# EAGLE design rotator_interface (EAGLE 6.1)
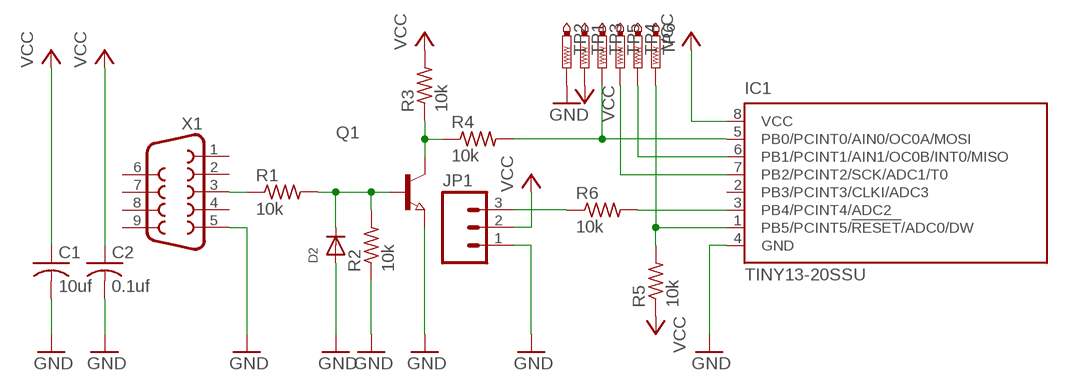
[diagram p0: schematic, sheet 1]

## Parts
C1  10uf  C-USC1206  [C1206]
C2  0.1uf  C-USC1206  [C1206]
D2  DIODESOD-123  [SOD-123]
IC1  TINY13-20SSU  [8S1]
JP1  M03PTH  [1X03]
Q1  NPN-TRANSISTOR_SOT23  [SOT23]
R1  10k  R-US_R1206  [R1206]
R2  10k  R-US_R1206  [R1206]
R3  10k  R-US_R1206  [R1206]
R4  10k  R-US_R1206  [R1206]
R5  10k  R-US_R1206  [R1206]
R6  10k  R-US_R1206  [R1206]
TP1  PTR1B1,27  [B1,27]
TP2  PTR1B1,27  [B1,27]
TP3  PTR1B1,27  [B1,27]
TP4  PTR1B1,27  [B1,27]
TP5  PTR1B1,27  [B1,27]
TP6  PTR1B1,27  [B1,27]
X1  DB9FEMALE  [DB9]

## Nets
GND: C1.2 C2.2 D2.A IC1.4(GND) JP1.1 Q1.2(E) R2.1 TP2.TP X1.5
N$1: Q1.3(C) R3.1 R4.1
N$2: D2.C Q1.1(B) R1.2 R2.2
N$3: R1.1 X1.3
N$4: IC1.5(PB0/PCINT0/AIN0/OC0A/MOSI) R4.2 TP3.TP
N$5: IC1.1(PB5/PCINT5/!RESET!/ADC0/DW) R5.2 TP6.TP
N$6: IC1.6(PB1/PCINT1/AIN1/OC0B/INT0/MISO) TP4.TP
N$7: IC1.7(PB2/PCINT2/SCK/ADC1/T0) TP5.TP
N$8: IC1.3(PB4/PCINT4/ADC2) R6.2
N$9: JP1.3 R6.1
VCC: C1.1 C2.1 IC1.8(VCC) JP1.2 R3.2 R5.1 TP1.TP
Unconnected: IC1.2(PB3/PCINT3/CLKI/ADC3) X1.1 X1.2 X1.4 X1.6 X1.7 X1.8 X1.9

## Library data of the parts
C1 C2 = adafruit:C-US: CAPACITOR, American symbol
D2 = adafruit:DIODE: Diode SMADIODE - SMA Surface Mount Package 20V 1A Schottky Diode Digikey: 641-1014-6-ND DO-1N4148 - Through Hole Small Current Diode SOD-123 20V 1 A (.5mV Vf) Schottky Diode - Digikey: MBRX120TPMSCT-ND SOD-323 10V 570mA (.38mV Vf, 3ns) Schottky Diode - Digikey: ZLLS410CT-ND SOD-523 30V 30mA Schottky Diode (RB751S-40TE61) - Digikey: RB751S-40TE61CT-ND SOT23-R/W - SOT23 Package (R = Solder Paste/Reflow Ovens, W = Hand-Soldering) BAT54Film 40V 300mA - Digikey: 497-7162-1-ND
IC1 = atmel:TINY13: 8-bit AVR Microcontroller with 1K Bytes In-System Programmable Flash Source: http://www.atmel.com/dyn/resources/prod_documents/2535S.pdf; MPN: ATTINY13-20SSU; OC_FARNELL: 1455133; OC_NEWARK: 58M3771
JP1 = sparkfun:M03: Header 3 Standard 3-pin 0.1" header. Use with straight break away headers (SKU : PRT-00116), right angle break away headers (PRT-00553), swiss pins (PRT-00743), machine pins (PRT-00117), and female headers (PRT-00115). Molex polarized connector foot print use with SKU : PRT-08232 with associated crimp pins and housings.
Q1 = semicon-smd-ipc:NPN-TRANSISTOR_: NPN TRANSISTOR
R1-R6 = resistor:R-US_: RESISTOR, American symbol
TP1-TP6 = testpad:PTR1: TEST PIN
X1 = sparkfun:DB9: DB9 Connector Standard DB9 (D-Sub 9) serial connector. Can be used for CAN bus as well as RS485 and RS232. Footprint production proven. Spark Fun Electronics SKU : PRT-00429

## Board
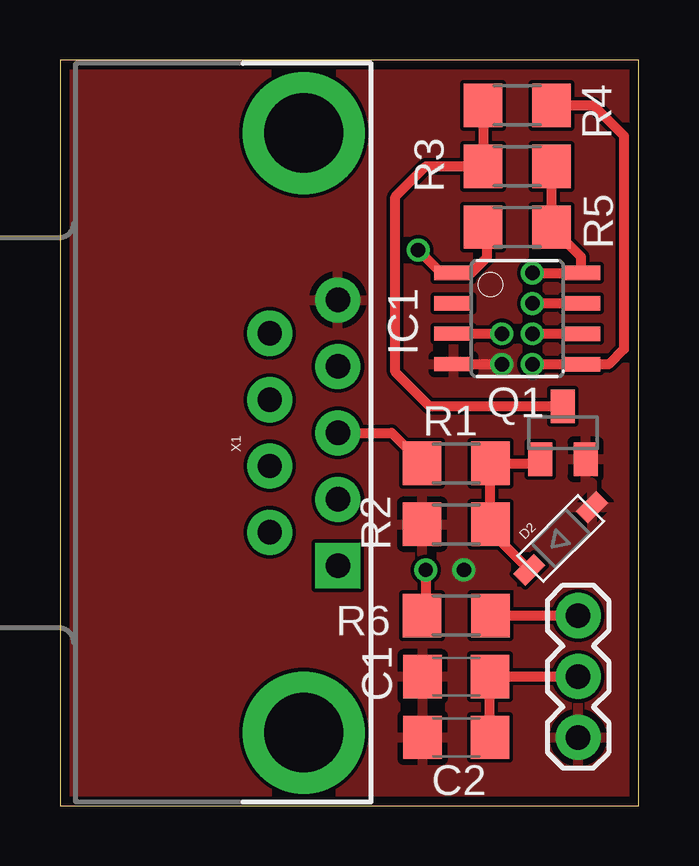
[diagram p1: board, top side]
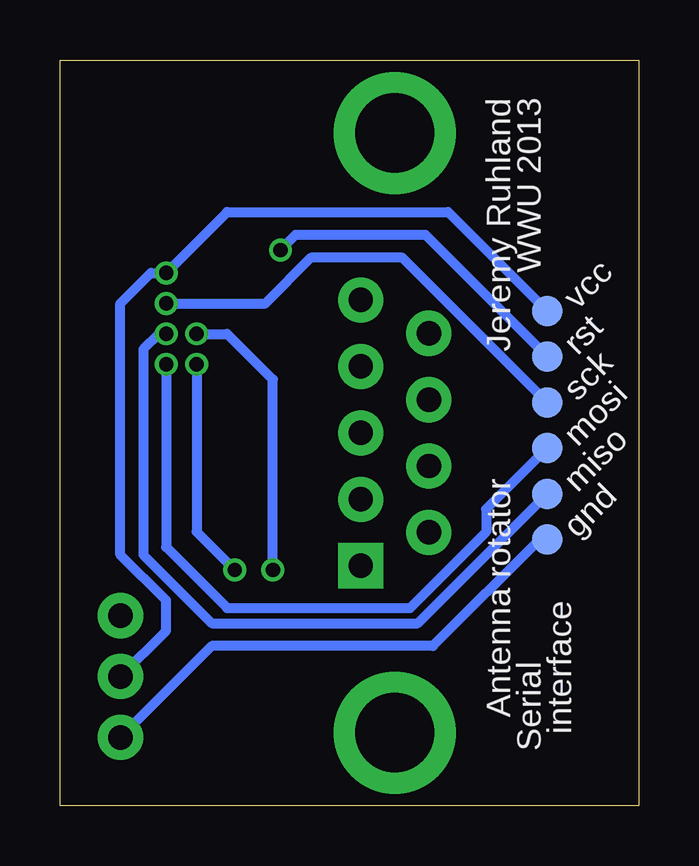
[diagram p2: board, bottom side, seen from below]

Size 24.11 x 31.1 mm. Coordinates in mm from the lower left corner, seen from the top.
Outline: 0,0 24.11,0 24.11,31.1 0,31.1 0,0
Copper layers (1*16): Top 0.0356mm / dielectric 1.5011mm / Bottom 0.0356mm
Design rules: minimum track width 6mil, minimum drill 13mil, track to track 6mil, track to pad 6mil, pad to pad 6mil, via to via 6mil, smd to smd 6mil, copper to edge 15mil, drill to drill 6mil, minimum pad ring 7mil, minimum via ring 7mil, stop-mask expansion 4mil, vias tented up to drill 0mil, thermal gap 10mil

### Footprints (pad centres in the part's own frame; a part is rotated, then mirrored left to right if it is on the bottom)
C1206 = smd 1.6 x 1.8: 1 -1.4,0; 2 1.4,0
SOD-123 = smd 1.2 x 0.7: A 1.85,0; C -1.85,0
8S1 = smd 0.6 x 1.6: 1 -1.905,-2.654; 2 -0.645,-2.654; 3 0.625,-2.654; 4 1.895,-2.654; 5 1.905,2.654; 6 0.635,2.654; 7 -0.635,2.654; 8 -1.905,2.654
1X03 = drill 1.016 pad 1.88: 1 0,0; 2 2.54,0; 3 5.08,0
SOT23 = smd 1 x 1.4: 1 -0.95,-1.1; 2 0.95,-1.1; 3 0,1.1
R1206 = smd 1.6 x 1.803: 1 -1.422,0; 2 1.422,0
B1,27 = smd 1.27 x 1.27: TP 0,0
DB9 = drill 1.016 pad 1.88 square: 1 -5.54,-1.42 | drill 1.016 pad 1.88: 2 -2.77,-1.42; 3 0,-1.42; 4 2.77,-1.42; 5 5.54,-1.42; 6 -4.15,1.42; 7 -1.38,1.42; 8 1.38,1.42; 9 4.15,1.42 | drill 3.302 pad 5.08: G1 -12.5,0; G2 12.5,0

### Placement (x,y rotation side)
C1  16.51,5.4 180 top
C2  16.51,2.86 180 top
D2  20.86,11.15 45 top
IC1  19.05,20.32 270 top
JP1  21.59,2.86 90 top
Q1  20.95,15.56 0 top
R1  16.51,14.29 0 top
R2  16.51,11.75 0 top
R3  19.05,26.67 0 top
R4  19.05,29.21 0 top
R5  19.05,24.13 180 top
R6  16.51,7.94 180 top
TP1  3.81,20.64 0 bottom
TP2  3.81,11.11 0 bottom
TP3  3.81,14.92 270 bottom
TP4  3.81,13.02 270 bottom
TP5  3.81,16.83 270 bottom
TP6  3.81,18.73 270 bottom
X1  10.16,15.56 90 top

### Tracks (layer width: path | path; a pad name or v marks a point on that pad's centre or on a via)
GND  (via drill 0.6)
  Top 0.406: IC1.4 18.09,18.43 v18.41,18.41
  Bottom 0.406: TP2.TP 4.13,11.11 8.57,6.67 17.78,6.67 JP1.1 | v18.41,18.41 18.41,11.43 v16.83,9.84
  pour Top: 0,30.8 24.13,30.8 24.13,0.32 0,0.32
N$1
  Top 0.406: Q1.3 15.41,16.66 13.97,18.1 13.97,25.4 15.24,26.67 R3.1 | R4.1 R3.1 | 17.78,26.67 R3.1
N$2
  Top 0.406: R1.2 R2.2 17.93,11.46 D2.C | R1.2 17.78,14.29 | R1.2 19.84,14.29 Q1.1
N$3
  Top 0.406: X1.3 13.82,15.56 R1.1
N$4  (via drill 0.6)
  Top 0.406: R4.2 22.23,29.21 23.5,27.94 23.5,19.05 22.86,18.41 IC1.5 v19.68,18.41
  Bottom 0.406: v19.68,18.41 19.68,10.79 17.14,8.26 9.53,8.26 6.35,11.43 6.35,12.38 TP3.TP
N$5  (via drill 0.6)
  Top 0.406: v14.92,23.18 15.88,22.23 IC1.1 17.14,22.23 17.78,22.86 17.78,23.98 R5.2
  Bottom 0.406: v14.92,23.18 14.29,23.81 8.89,23.81 TP6.TP
N$6  (via drill 0.6)
  Top 0.406: IC1.6 v19.68,19.68
  Bottom 0.406: v19.68,19.68 20,19.68 20.64,19.05 20.64,10.48 17.78,7.62 9.21,7.62 TP4.TP
N$7  (via drill 0.6)
  Top 0.406: IC1.7 v19.68,20.95
  Bottom 0.406: v19.68,20.95 15.56,20.95 13.65,22.86 9.84,22.86 TP5.TP
N$8  (via drill 0.6)
  Top 0.406: IC1.3 18.41,19.7 v18.41,19.68 | 15.24,7.94 R6.2 15.24,8.09 v15.24,9.84
  Bottom 0.406: v18.41,19.68 17.14,19.68 15.24,17.78 v15.24,9.84
N$9
  Top 0.406: R6.1 JP1.3
VCC  (via drill 0.6)
  Top 0.406: C2.1 C1.1 JP1.2 | v19.68,22.23 IC1.8 21.7,22.9 R5.1 R3.2
  Bottom 0.406: JP1.2 19.68,7.3 19.68,8.57 21.59,10.48 21.59,20.95 20.32,22.23 v19.68,22.23 17.14,24.77 7.94,24.77 TP1.TP

### Text on the board
_bsilk: WWU 2013 | Jeremy Ruhland | vcc | rst | sck | mosi | Antenna rotator | miso | gnd | interface | Serial